# Altium schematic sheet OLED Display.SchDoc: DO NOT FILL THIS IN
size Tabloid; Date: DO NOT FILL THIS IN; ApprovedBy: DO NOT FILL THIS IN; CheckedBy: DO NOT FILL THIS IN; Author: DO NOT FILL THIS IN; CompanyName: DO NOT FILL THIS IN; DrawnBy: DO NOT FILL THIS IN; Engineer: DO NOT FILL THIS IN; Organization: DO NOT FILL THIS IN; Address1: DO NOT FILL THIS IN; Address2: DO NOT FILL THIS IN; Address3: DO NOT FILL THIS IN; Address4: DO NOT FILL THIS IN; DocumentNumber: DO NOT FILL THIS IN; Revision: DO NOT FILL THIS IN; SheetNumber: 2; SheetTotal: 10; PageSetup: Record=PageOptions|CenterHorizontal=True|CenterVertical=True|PrintScale=1.00|XCorrection=1.00|YCorrection=1.00|PrintKind=1|BorderSize=5000000|LeftOffset=0|BottomOffset=0|Orientation=2|PaperLength=1000|PaperWidth=1000|Scale=100|PaperSource=7|PrintQuality=-4|MediaType=1|DitherType=10|PaperKind=Ledger|PrintScaleMode=1; cpr-ItemNumber: XXXXXX; cpr-ItemName1: XXXXX, XXXXXX, XXXXXX—XXXX Ø × ±; cpr-ItemName2: XXXXXX XXXXXX; cpr-Revision: X; cpr-SheetNumber: X; cpr-SheetTotal: 1; cpr-Draft: XXX; cpr-DraftDate: D MMM YYYY; Time: DO NOT FILL THIS IN; ImagePath: DO NOT FILL THIS IN; Application_BuildNumber: DO NOT FILL THIS IN
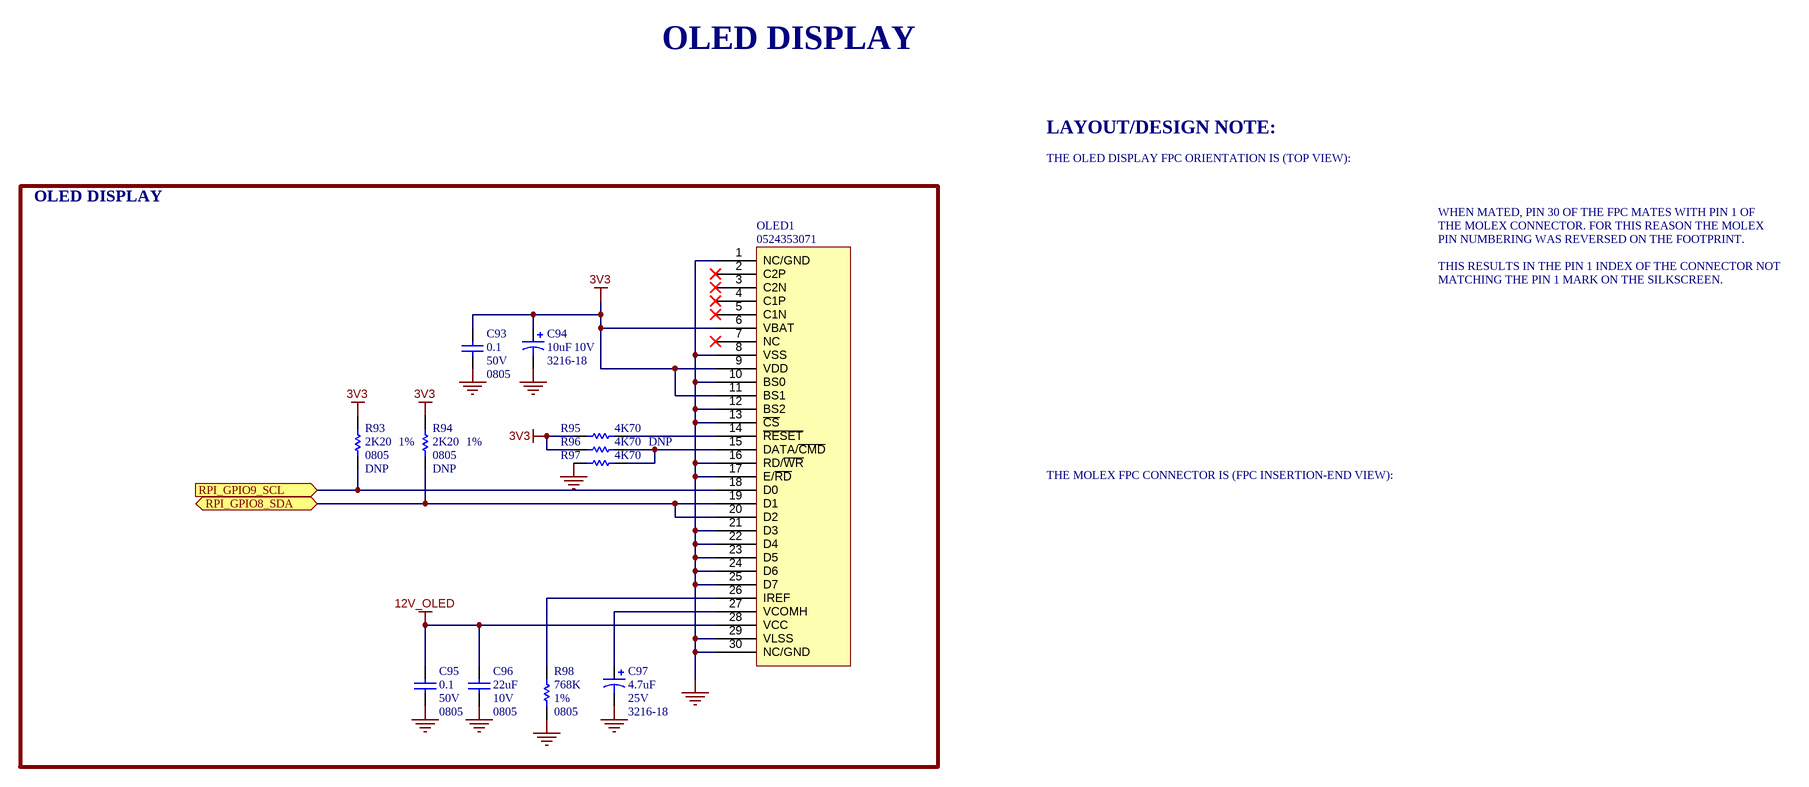
[diagram p0: OLED Display.SchDoc]

## Parts
C93  value 0.1  Voltage: 50V  Package: 0805  [C0805]  (hidden comment: Capacitor _SMT)
C94  value 10uF  Voltage: 10V  Package: 3216-18  [CAP_TANT_3216-18]  (hidden comment: Cap Pol1)
C95  value 0.1  Voltage: 50V  Package: 0805  [C0805]  (hidden comment: Capacitor _SMT)
C96  value 22uF  Voltage: 10V  Package: 0805  [C0805]  (hidden comment: Capacitor _SMT)
C97  value 4.7uF  Voltage: 25V  Package: 3216-18  [CAP_TANT_3216-18]  (hidden comment: Cap Pol1)
OLED1  Mfg PN: 0524353071  [MOLEX_0524353071_REV]  (hidden comment: 128x64 OLED)
R93  value 2K20  Tolerance: 1%  Package: 0805  [R0805]  (hidden comment: Resistor_SMT)
R94  value 2K20  Tolerance: 1%  Package: 0805  [R0805]  (hidden comment: Resistor_SMT)
R95  value 4K70  [R0805]  (hidden comment: Resistor_SMT)
R96  value 4K70  [R0805]  (hidden comment: Resistor_SMT)
R97  value 4K70  [R0805]  (hidden comment: Resistor_SMT)
R98  value 768K  Tolerance: 1%  Package: 0805  [R0805]  (hidden comment: Resistor_SMT)

## Blocks framed on the sheet
OLED DISPLAY: C93-C97 OLED1 R93-R98

## Ports
RPI_GPIO8_SDA (bidir), RPI_GPIO9_SCL (in)

## Nets
3V3: C93.2 C94.1 OLED1.6(VBAT) OLED1.9(VDD) OLED1.11(BS1) R93.1 R94.1 R95.2 R96.2
12V_OLED: C95.2 C96.2 OLED1.28(VCC)
GND: C93.1 C94.2 C95.1 C96.1 C97.2 OLED1.1(NC/GND) OLED1.8(VSS) OLED1.10(BS0) OLED1.12(BS2) OLED1.13(~{CS}) OLED1.16(RD/~{WR}) OLED1.17(E/~{RD}) OLED1.21(D3) OLED1.22(D4) OLED1.23(D5) OLED1.24(D6) OLED1.25(D7) OLED1.29(VLSS) OLED1.30(NC/GND) R97.2 R98.2
RPI_GPIO8_SDA: OLED1.19(D1) OLED1.20(D2) R94.2 ; port RPI_GPIO8_SDA
RPI_GPIO9_SCL: OLED1.18(D0) R93.2 ; port RPI_GPIO9_SCL
NetC97_1: C97.1 OLED1.27(VCOMH)
NetOLED1_14: OLED1.14(~{RESET}) R95.1
NetOLED1_15: OLED1.15(DATA/~{CMD}) R96.1 R97.1
NetOLED1_26: OLED1.26(IREF) R98.1

Not connected (* = marked no-connect by the designer): OLED1 2(C2P)* 3(C2N)* 4(C1P)* 5(C1N)* 7(NC)*

## Notes on the sheet
- OLED DISPLAY
- LAYOUT/DESIGN NOTE:
- THE OLED DISPLAY FPC ORIENTATION IS (TOP VIEW):
- WHEN MATED, PIN 30 OF THE FPC MATES WITH PIN 1 OF
- THE MOLEX CONNECTOR. FOR THIS REASON THE MOLEX
- PIN NUMBERING WAS REVERSED ON THE FOOTPRINT.
- THIS RESULTS IN THE PIN 1 INDEX OF THE CONNECTOR NOT
- MATCHING THE PIN 1 MARK ON THE SILKSCREEN.
- THE MOLEX FPC CONNECTOR IS (FPC INSERTION-END VIEW):
- 1
- 2
- 3
- 4
- 5
- 6
- 7
- 8
- 9
- 10
- 11
- 12
- 13
- 14
- 15
- 16
- J
- I
- H
- G
- F
- E
- D
- C
- B
- A
- THIRD ANGLE
- PROJECTION
- UNLESS OTHERWISE SPECIFIED
- COPYRIGHT 2021, CLEARPATH ROBOTICS INC.
- DRAFT
- REV.
- UNITS ARE MILLIMETRES & GRAMS
- NOTES SUPERSEDE TITLE BLOCK
- CALLOUTS SUPERSEDE NOTES
- LICENSED UNDER THE SOLDERPAD HARDWARE LICENSE V2.1
- (THE "LICENSE"); YOU MAY NOT USE THIS FILE EXCEPT IN COMPLIANCE
- WITH THE LICENSE, OR, AT YOUR OPTION, THE APACHE LICENSE
- VERSION 2.0. YOU MAY OBTAIN A COPY OF THE LICENSE AT
- https://solderpad.org/licenses/SHL-2.1/ <https://solderpad.https://solderpad.org/licenses/SHL-2.1/org/licenses/SHL-2.1/>
- RIGOUR 2
- RIGOUR 1
- ITEM
- NAME
- PAPER 432 X 279   ( 11" X 17" )
- DO NOT SCALE
- NUMBER
- SHEET
- OF

## Library data of the parts
C93 C95 = Capacitor _SMT: Capacitor; Tolerance: 10%; Vendor: Digikey; Vendor PN: 311-1140-1-ND; Mfg: Yageo; Mfg PN: CC0805KRX7R9BB104; DNP: *
C94 = Cap Pol1: Polarized Capacitor (Radial); Vendor: Digikey; Mfg PN: T494A106K010AT; Vendor PN: 399-8431-1-ND; Tolerance: 10%; Mfg: Kemet
C96 = Capacitor _SMT: Capacitor; Tolerance: -20 +80; Vendor: Digikey; Vendor PN: 311-3444-1-ND; Mfg: Yageo; Mfg PN: CC0805ZKY5V6BB226; DNP: *
C97 = Cap Pol1: Polarized Capacitor (Radial); Vendor: Digikey; Mfg PN: TAJA475M025RNJ; Vendor PN: 478-8885-1-ND; Tolerance: 10%; Mfg: Kemet
OLED1 = ER-OLED013-1: 128x64 OLED module; Manufacturer: Molex; Vendor PN: WM7976CT-ND; Vendor: Digikey
R93 R94 = Resistor_SMT: Resistor; Vendor: Digikey; Vendor PN: 311-2.20KCRCT-ND; Mfg: Yageo; Mfg PN: RC0805FR-072K2L; Power Rating: *; DNP: DNP
R95-R97 = Resistor_SMT: Resistor; Vendor: Digikey; Vendor PN: 13-RC0805FR-104K7LCT-ND; Tolerance: 1%; Mfg: Yageo; Mfg PN: RC0805FR-104K7L; Power Rating: *; Package: 0805
  R96: DNP: DNP
R98 = Resistor_SMT: Resistor; Vendor: Digikey; Vendor PN: 311-768KCRCT-ND; Mfg: Yageo; Mfg PN: RC0805FR-07768KL; Power Rating: *